# Altium schematic sheet connectors.SchDoc: foxBMS BMS-Slave 12-Cell
size A3; DocumentNumber: 10; SheetNumber: 10; SheetTotal: 15; AUTHOR: Fraunhofer IISB foxBMS Team; SheetDescription: Connectors
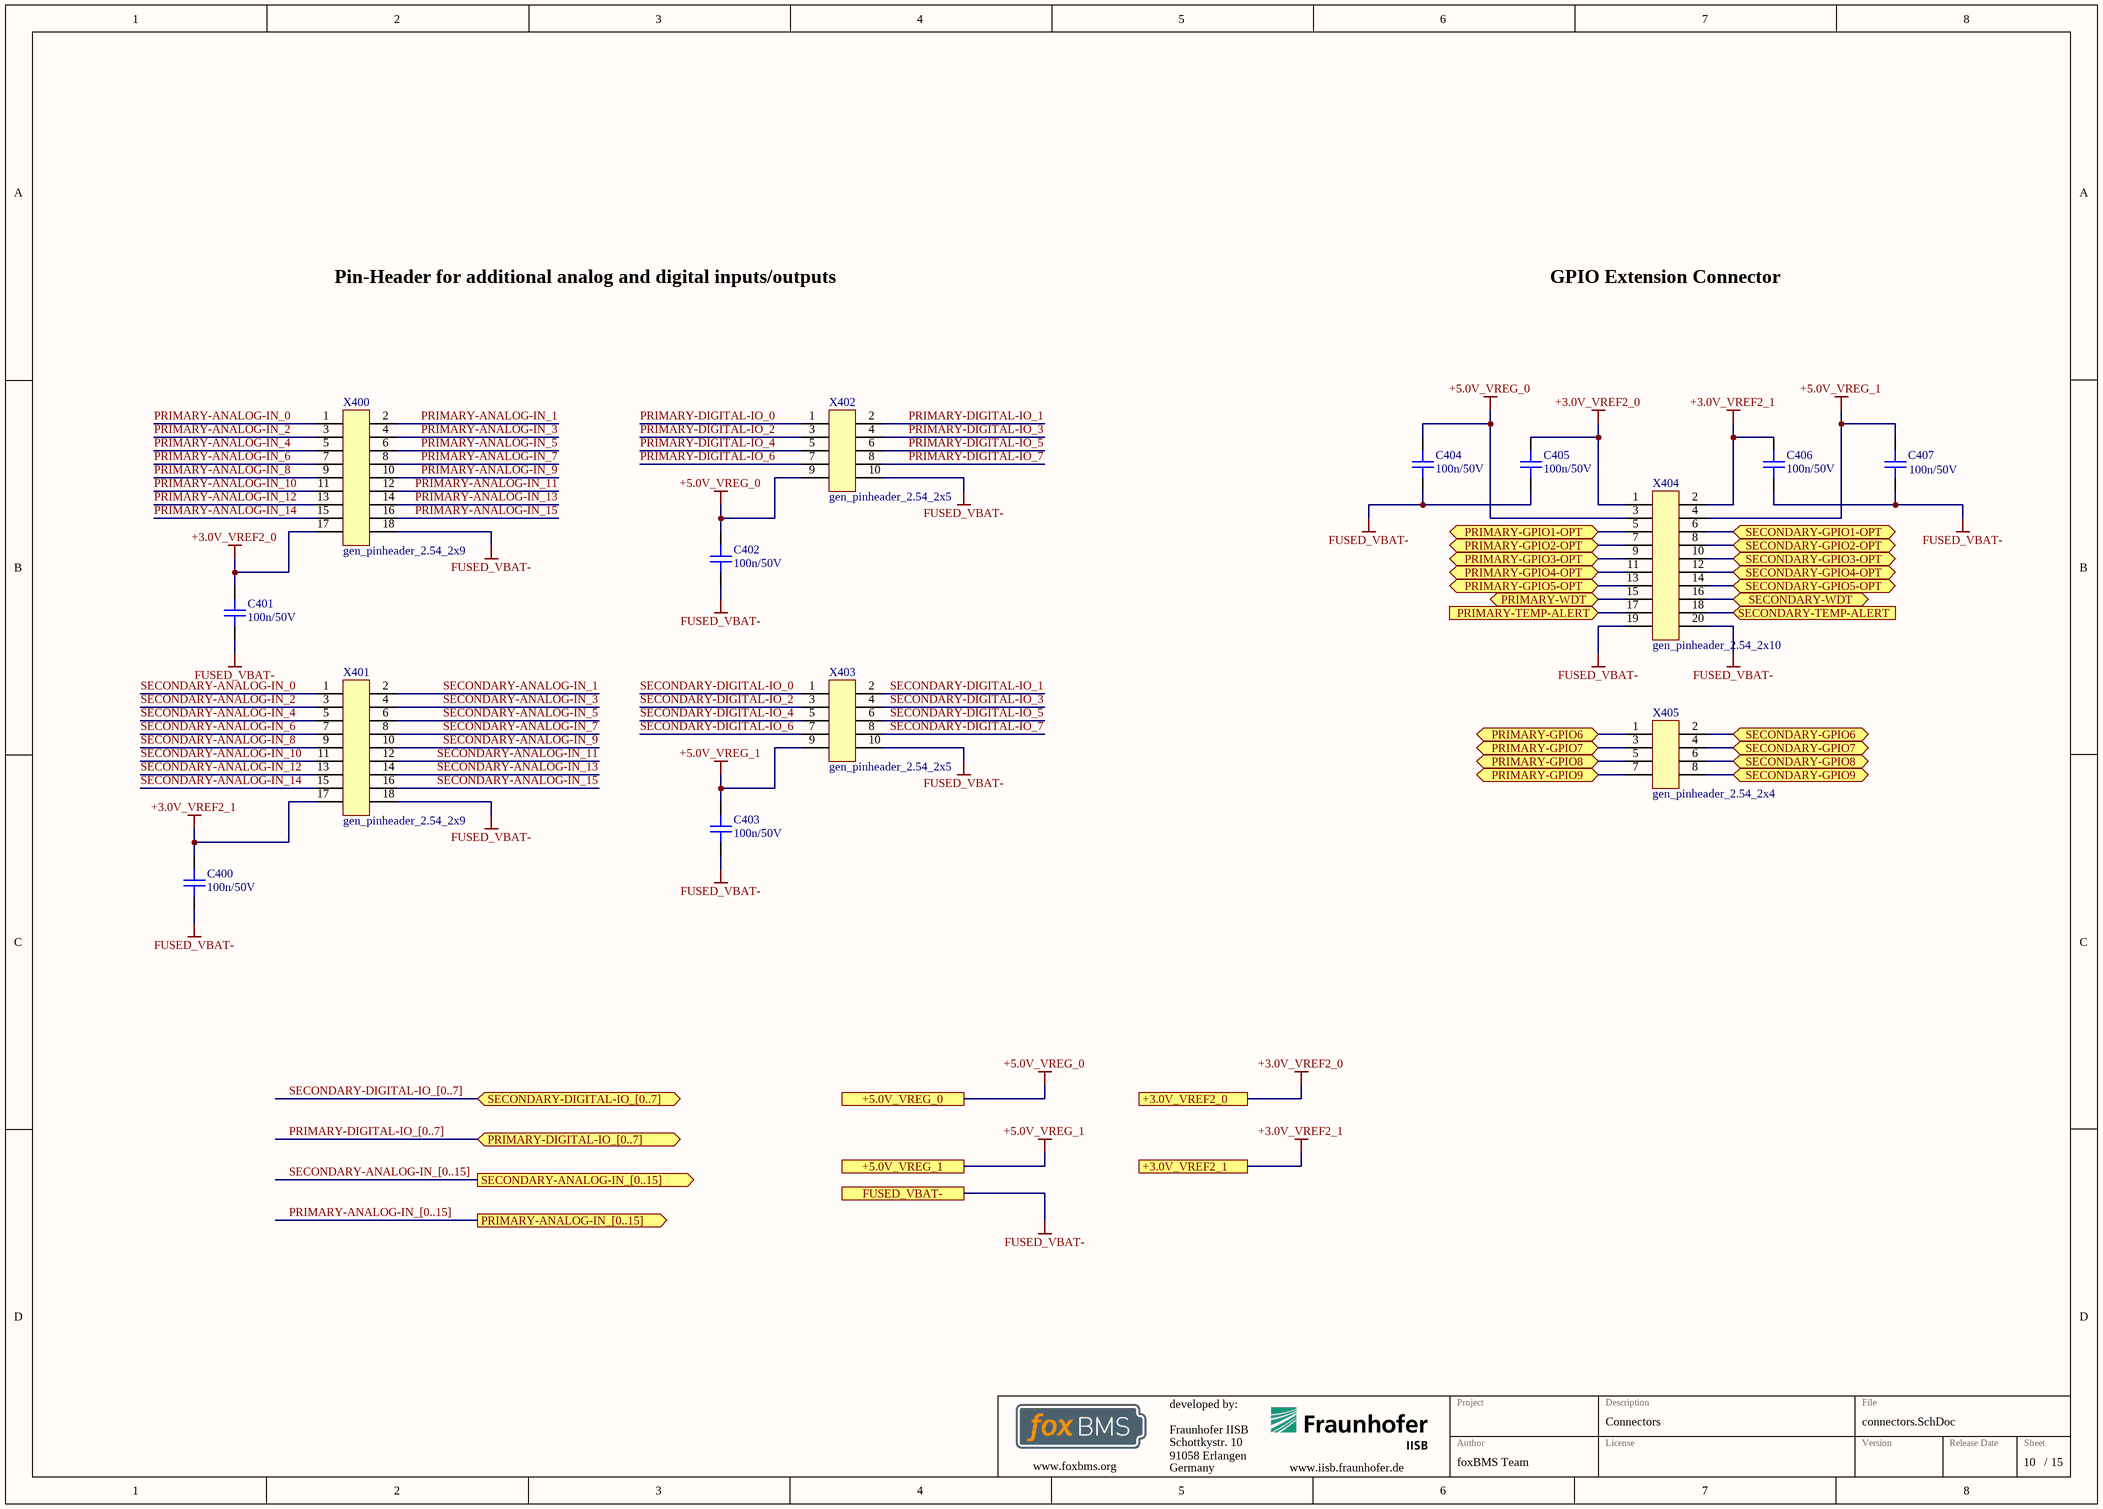
[diagram p0: connectors.SchDoc]

## Parts
C400  100n/50V  [CAPC1608X08N]
C401  100n/50V  [CAPC1608X08N]
C402  100n/50V  [CAPC1608X08N]
C403  100n/50V  [CAPC1608X08N]
C404  100n/50V  [CAPC1608X08N]
C405  100n/50V  [CAPC1608X08N]
C406  100n/50V  [CAPC1608X08N]
C407  100n/50V  [CAPC1608X08N]
X400  gen_pinheader_2.54_2x9  [Pinheader_2.54_2x9]
X401  gen_pinheader_2.54_2x9  [Pinheader_2.54_2x9]
X402  gen_pinheader_2.54_2x5  [Pinheader_2.54_2x5]
X403  gen_pinheader_2.54_2x5  [Pinheader_2.54_2x5]
X404  gen_pinheader_2.54_2x10  [Pinheader_2.54_2x10]
X405  gen_pinheader_2.54_2x4  [Pinheader_2.54_2x4]

## Ports
+3.0V_VREF2_0, +3.0V_VREF2_1, +5.0V_VREG_0, +5.0V_VREG_1, FUSED_VBAT-, PRIMARY-ANALOG-IN_[0..15] (out), PRIMARY-DIGITAL-IO_[0..7] (bidir), PRIMARY-GPIO1-OPT (bidir), PRIMARY-GPIO2-OPT (bidir), PRIMARY-GPIO3-OPT (bidir), PRIMARY-GPIO4-OPT (bidir), PRIMARY-GPIO5-OPT (bidir), PRIMARY-GPIO6 (bidir), PRIMARY-GPIO7 (bidir), PRIMARY-GPIO8 (bidir), PRIMARY-GPIO9 (bidir), PRIMARY-TEMP-ALERT (in), PRIMARY-WDT (bidir), SECONDARY-ANALOG-IN_[0..15] (out), SECONDARY-DIGITAL-IO_[0..7] (bidir), SECONDARY-GPIO1-OPT (bidir), SECONDARY-GPIO2-OPT (bidir), SECONDARY-GPIO3-OPT (bidir), SECONDARY-GPIO4-OPT (bidir), SECONDARY-GPIO5-OPT (bidir), SECONDARY-GPIO6 (bidir), SECONDARY-GPIO7 (bidir), SECONDARY-GPIO8 (bidir), SECONDARY-GPIO9 (bidir), SECONDARY-TEMP-ALERT (in), SECONDARY-WDT (bidir)

## Nets
+3.0V_VREF2_0: C401.2 C405.2 X400.17 X404.1 ; port +3.0V_VREF2_0
+3.0V_VREF2_1: C400.2 C406.2 X401.17 X404.2 ; port +3.0V_VREF2_1
+5.0V_VREG_0: C402.2 C404.2 X402.9 X404.3 ; port +5.0V_VREG_0
+5.0V_VREG_1: C403.2 C407.2 X403.9 X404.4 ; port +5.0V_VREG_1
FUSED_VBAT-: C400.1 C401.1 C402.1 C403.1 C404.1 C405.1 C406.1 C407.1 X400.18 X401.18 X402.10 X403.10 X404.19 X404.20 ; port FUSED_VBAT-
PRIMARY-ANALOG-IN_0: X400.1
PRIMARY-ANALOG-IN_1: X400.2
PRIMARY-ANALOG-IN_2: X400.3
PRIMARY-ANALOG-IN_3: X400.4
PRIMARY-ANALOG-IN_4: X400.5
PRIMARY-ANALOG-IN_5: X400.6
PRIMARY-ANALOG-IN_6: X400.7
PRIMARY-ANALOG-IN_7: X400.8
PRIMARY-ANALOG-IN_8: X400.9
PRIMARY-ANALOG-IN_9: X400.10
PRIMARY-ANALOG-IN_10: X400.11
PRIMARY-ANALOG-IN_11: X400.12
PRIMARY-ANALOG-IN_12: X400.13
PRIMARY-ANALOG-IN_13: X400.14
PRIMARY-ANALOG-IN_14: X400.15
PRIMARY-ANALOG-IN_15: X400.16
PRIMARY-DIGITAL-IO_0: X402.1
PRIMARY-DIGITAL-IO_1: X402.2
PRIMARY-DIGITAL-IO_2: X402.3
PRIMARY-DIGITAL-IO_3: X402.4
PRIMARY-DIGITAL-IO_4: X402.5
PRIMARY-DIGITAL-IO_5: X402.6
PRIMARY-DIGITAL-IO_6: X402.7
PRIMARY-DIGITAL-IO_7: X402.8
PRIMARY-GPIO1-OPT: X404.5 ; port PRIMARY-GPIO1-OPT
PRIMARY-GPIO2-OPT: X404.7 ; port PRIMARY-GPIO2-OPT
PRIMARY-GPIO3-OPT: X404.9 ; port PRIMARY-GPIO3-OPT
PRIMARY-GPIO4-OPT: X404.11 ; port PRIMARY-GPIO4-OPT
PRIMARY-GPIO5-OPT: X404.13 ; port PRIMARY-GPIO5-OPT
PRIMARY-GPIO6: X405.1 ; port PRIMARY-GPIO6
PRIMARY-GPIO7: X405.3 ; port PRIMARY-GPIO7
PRIMARY-GPIO8: X405.5 ; port PRIMARY-GPIO8
PRIMARY-GPIO9: X405.7 ; port PRIMARY-GPIO9
PRIMARY-TEMP-ALERT: X404.17 ; port PRIMARY-TEMP-ALERT
PRIMARY-WDT: X404.15 ; port PRIMARY-WDT
SECONDARY-ANALOG-IN_0: X401.1
SECONDARY-ANALOG-IN_1: X401.2
SECONDARY-ANALOG-IN_2: X401.3
SECONDARY-ANALOG-IN_3: X401.4
SECONDARY-ANALOG-IN_4: X401.5
SECONDARY-ANALOG-IN_5: X401.6
SECONDARY-ANALOG-IN_6: X401.7
SECONDARY-ANALOG-IN_7: X401.8
SECONDARY-ANALOG-IN_8: X401.9
SECONDARY-ANALOG-IN_9: X401.10
SECONDARY-ANALOG-IN_10: X401.11
SECONDARY-ANALOG-IN_11: X401.12
SECONDARY-ANALOG-IN_12: X401.13
SECONDARY-ANALOG-IN_13: X401.14
SECONDARY-ANALOG-IN_14: X401.15
SECONDARY-ANALOG-IN_15: X401.16
SECONDARY-DIGITAL-IO_0: X403.1
SECONDARY-DIGITAL-IO_1: X403.2
SECONDARY-DIGITAL-IO_2: X403.3
SECONDARY-DIGITAL-IO_3: X403.4
SECONDARY-DIGITAL-IO_4: X403.5
SECONDARY-DIGITAL-IO_5: X403.6
SECONDARY-DIGITAL-IO_6: X403.7
SECONDARY-DIGITAL-IO_7: X403.8
SECONDARY-GPIO1-OPT: X404.6 ; port SECONDARY-GPIO1-OPT
SECONDARY-GPIO2-OPT: X404.8 ; port SECONDARY-GPIO2-OPT
SECONDARY-GPIO3-OPT: X404.10 ; port SECONDARY-GPIO3-OPT
SECONDARY-GPIO4-OPT: X404.12 ; port SECONDARY-GPIO4-OPT
SECONDARY-GPIO5-OPT: X404.14 ; port SECONDARY-GPIO5-OPT
SECONDARY-GPIO6: X405.2 ; port SECONDARY-GPIO6
SECONDARY-GPIO7: X405.4 ; port SECONDARY-GPIO7
SECONDARY-GPIO8: X405.6 ; port SECONDARY-GPIO8
SECONDARY-GPIO9: X405.8 ; port SECONDARY-GPIO9
SECONDARY-TEMP-ALERT: X404.18 ; port SECONDARY-TEMP-ALERT
SECONDARY-WDT: X404.16 ; port SECONDARY-WDT

## Buses and harness runs
bus PRIMARY-ANALOG-IN_[0..15] = port PRIMARY-ANALOG-IN_[0..15]
bus PRIMARY-DIGITAL-IO_[0..7] = port PRIMARY-DIGITAL-IO_[0..7]
bus SECONDARY-ANALOG-IN_[0..15] = port SECONDARY-ANALOG-IN_[0..15]
bus SECONDARY-DIGITAL-IO_[0..7] = port SECONDARY-DIGITAL-IO_[0..7]

## Notes on the sheet
- Pin-Header for additional analog and digital inputs/outputs
- GPIO Extension Connector
- Fraunhofer IISB
- Schottkystr. 10
- developed by:
- 91058 Erlangen
- Germany
- Author
- Project
- License
- Description
- File
- Version
- Release Date
- Sheet
- www.foxbms.org
- www.iisb.fraunhofer.de
- foxBMS Team
- /

## Library data of the parts
C400-C407 = gen_C_ceramic_100n_50V_X7R_0603: MLCC; Capacitance: 100n; Rated Voltage: 50V; Dielectric: X7R; Case EIA: 0603; Case Metric: 1608; PnP Package: C_0603_10; PnP Value: 100n/50V/X7R; PnP equipped: x; Automotive Qualified: True; Part Number: gen_C_ceramic_100n_50V_X7R_0603; Supplier 1: Farnell; Supplier Part Number 1: 2525267; Supplier 2: Digikey; Supplier Part Number 2: 490-6049-1-ND; Supplier 3: Farnell; Supplier Part Number 3: 2070398
X400 X401 = gen_pinheader_2.54_2x9: Standard Pinheader, THD, gerade, 2.54mm, 2-reihig; Circuits: 18; Rated Voltage: 250V; Rated Current: 3A; Automotive Qualified: False; Part Number: gen_pinheader_2.54_2x9; Part Name: PinHeader; Operating Temperature: −40 °C - +105 °C; Supplier 1: Farnell; Supplier Part Number 1: 2025256
X402 X403 = gen_pinheader_2.54_2x5: Standard Pinheader, THD, gerade, 2.54mm, 2-reihig; Circuits: 10; Rated Voltage: 250V; Rated Current: 3A; Automotive Qualified: False; Part Number: gen_pinheader_2.54_2x5; Part Name: PinHeader; Operating Temperature: −40 °C - +105 °C; Supplier 1: Farnell; Supplier Part Number 1: 2578720
X404 = gen_pinheader_2.54_2x10: Standard Pinheader, THD, gerade, 2.54mm, 2-reihig; Circuits: 20; Rated Voltage: 250V; Rated Current: 3A; Automotive Qualified: False; Part Number: gen_pinheader_2.54_2x10; Part Name: PinHeader; Operating Temperature: −40 °C - +105 °C; Supplier 1: Farnell; Supplier Part Number 1: 2779676
X405 = gen_pinheader_2.54_2x4: Standard Pinheader, THD, gerade, 2.54mm, 2-reihig; Circuits: 8; Rated Voltage: 250V; Rated Current: 3A; Automotive Qualified: False; Part Number: gen_pinheader_2.54_2x4; Part Name: PinHeader; Operating Temperature: −40 °C - +105 °C; Supplier 1: Farnell; Supplier Part Number 1: 2856692